# EAGLE design shield (EAGLE 9.6.2)
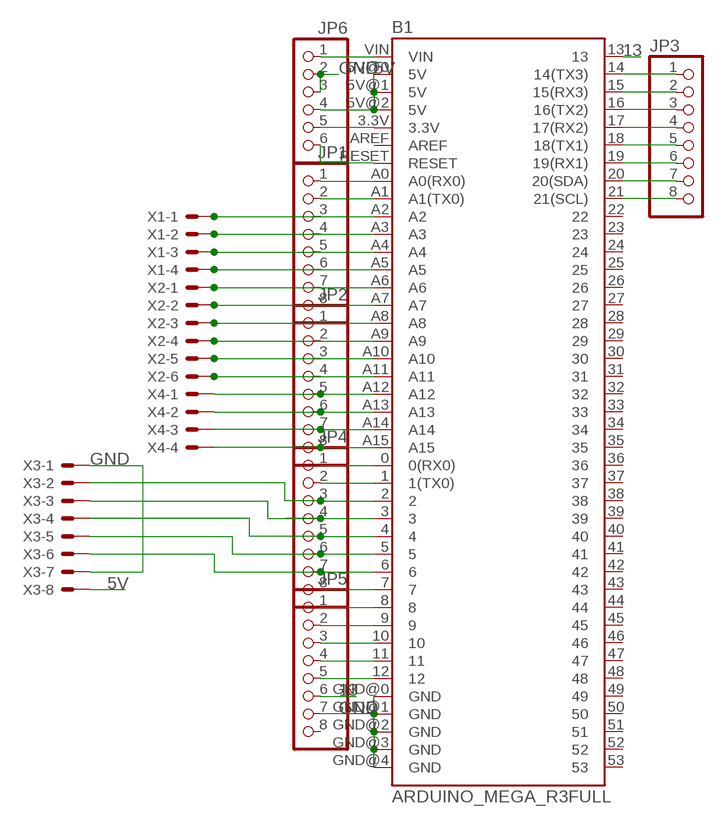
[diagram p0: schematic, sheet 1]

## Parts
B1  ARDUINO_MEGA_R3FULL  [ARDUINO_MEGA]
JP1  PINHD-1X8  [1X08]
JP2  PINHD-1X8  [1X08]
JP3  PINHD-1X8  [1X08]
JP4  PINHD-1X8  [1X08]
JP5  PINHD-1X8  [1X08]
JP6  PINHD-1X6  [1X06]
X1  JST-XH-04-PIN-LONG-PAD  [JST-XH-04-PACKAGE-LONG-PAD]
X2  JST-XH-06-PIN-LONG-PAD  [JST-XH-06-PACKAGE-LONG-PAD]
X3  JST-XH-08-PIN-LONG-PAD  [JST-XH-08-PACKAGE-LONG-PAD]
X4  JST-XH-04-PIN-LONG-PAD  [JST-XH-04-PACKAGE-LONG-PAD]

## Nets
5V: B1.5V@0(5V) B1.5V@1(5V) B1.5V@2(5V) JP6.4 X3.8
13: B1.13 JP5.6
GND: B1.GND@0(GND) B1.GND@1(GND) B1.GND@2(GND) B1.GND@3(GND) B1.GND@4(GND) JP5.7 JP6.2 JP6.3 X3.1 X3.7
N$1: B1.A0(A0(RX0)) JP1.1
N$2: B1.A1(A1(TX0)) JP1.2
N$3: B1.A2 JP1.3 X1.1
N$4: B1.A3 JP1.4 X1.2
N$5: B1.A4 JP1.5 X1.3
N$6: B1.A5 JP1.6 X1.4
N$7: B1.A6 JP1.7 X2.1
N$8: B1.A7 JP1.8 X2.2
N$9: B1.A8 JP2.1 X2.3
N$10: B1.A9 JP2.2 X2.4
N$11: B1.A10 JP2.3 X2.5
N$12: B1.A11 JP2.4 X2.6
N$13: B1.A12 JP2.5 X4.1
N$14: B1.A13 JP2.6 X4.2
N$15: B1.A14 JP2.7 X4.3
N$16: B1.A15 JP2.8 X4.4
N$17: B1.14(14(TX3)) JP3.1
N$18: B1.15(15(RX3)) JP3.2
N$19: B1.16(16(TX2)) JP3.3
N$20: B1.17(17(RX2)) JP3.4
N$21: B1.18(18(TX1)) JP3.5
N$22: B1.19(19(RX1)) JP3.6
N$23: B1.20(20(SDA)) JP3.7
N$24: B1.21(21(SCL)) JP3.8
N$25: B1.0(0(RX0)) JP4.1
N$26: B1.1(1(TX0)) JP4.2
N$27: B1.2 JP4.3 X3.2
N$29: B1.4 JP4.5 X3.4
N$32: B1.7 JP4.8
N$33: B1.8 JP5.1
N$34: B1.9 JP5.2
N$35: B1.10 JP5.3
N$36: B1.11 JP5.4
N$37: B1.12 JP5.5
N$38: B1.VIN JP6.1
N$39: B1.3.3V JP6.5
N$40: B1.RESET JP6.6
N$41: B1.3 JP4.4 X3.3
N$46: B1.5 JP4.6 X3.5
N$47: B1.6 JP4.7 X3.6
Unconnected: B1.22 B1.23 B1.24 B1.25 B1.26 B1.27 B1.28 B1.29 B1.30 B1.31 B1.32 B1.33 B1.34 B1.35 B1.36 B1.37 B1.38 B1.39 B1.40 B1.41 B1.42 B1.43 B1.44 B1.45 B1.46 B1.47 B1.48 B1.49 B1.50 B1.51 B1.52 B1.53 B1.AREF JP5.8

## Library data of the parts
B1 = SparkFun-Boards:ARDUINO_MEGA_R3: Arduino Mega R3 ATmega2560 R3 compatible footprint. SparkFun Products: Arduino Mega 2560 R3 <https://www.sparkfun.com/products/11061>
JP1-JP5 = pinhead:PINHD-1X8: PIN HEADER
JP6 = pinhead:PINHD-1X6: PIN HEADER
X1 X4 = JST:JST-XH-04-PIN: JST XH Connector 2 Pin Wire to board connector. Pitch: 2,54 mm, (0.100") Number of pins: 4 Created by Rembrandt Electronics www.rembrandtelectronics.com
X2 = JST:JST-XH-06-PIN: JST XH Connector 2 Pin Wire to board connector. Pitch: 2,54 mm, (0.100") Number of pins: 6 Created by Rembrandt Electronics www.rembrandtelectronics.com
X3 = JST:JST-XH-08-PIN: JST XH Connector 2 Pin Wire to board connector. Pitch: 2,54 mm, (0.100") Number of pins: 8 Created by Rembrandt Electronics www.rembrandtelectronics.com

## Net classes
0 default: width 0.3 mm, drill 0.203 mm, clearance 0.3 mm

## Board
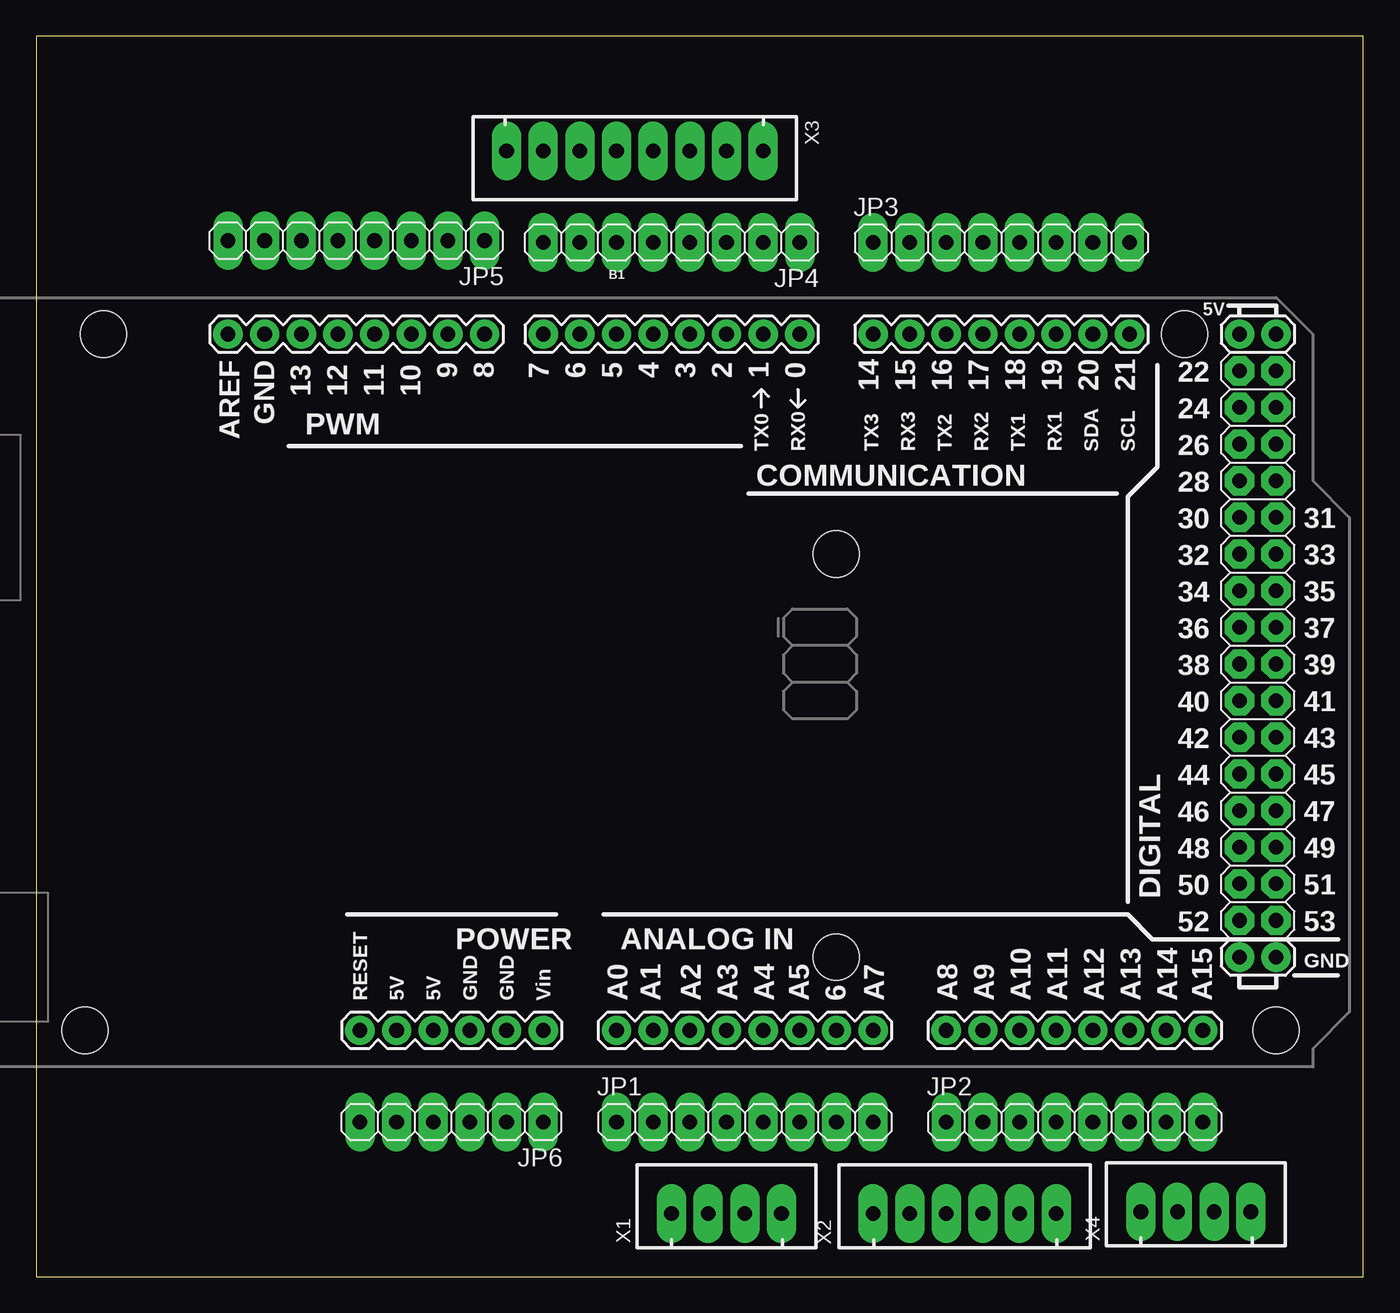
[diagram p1: board, top side]
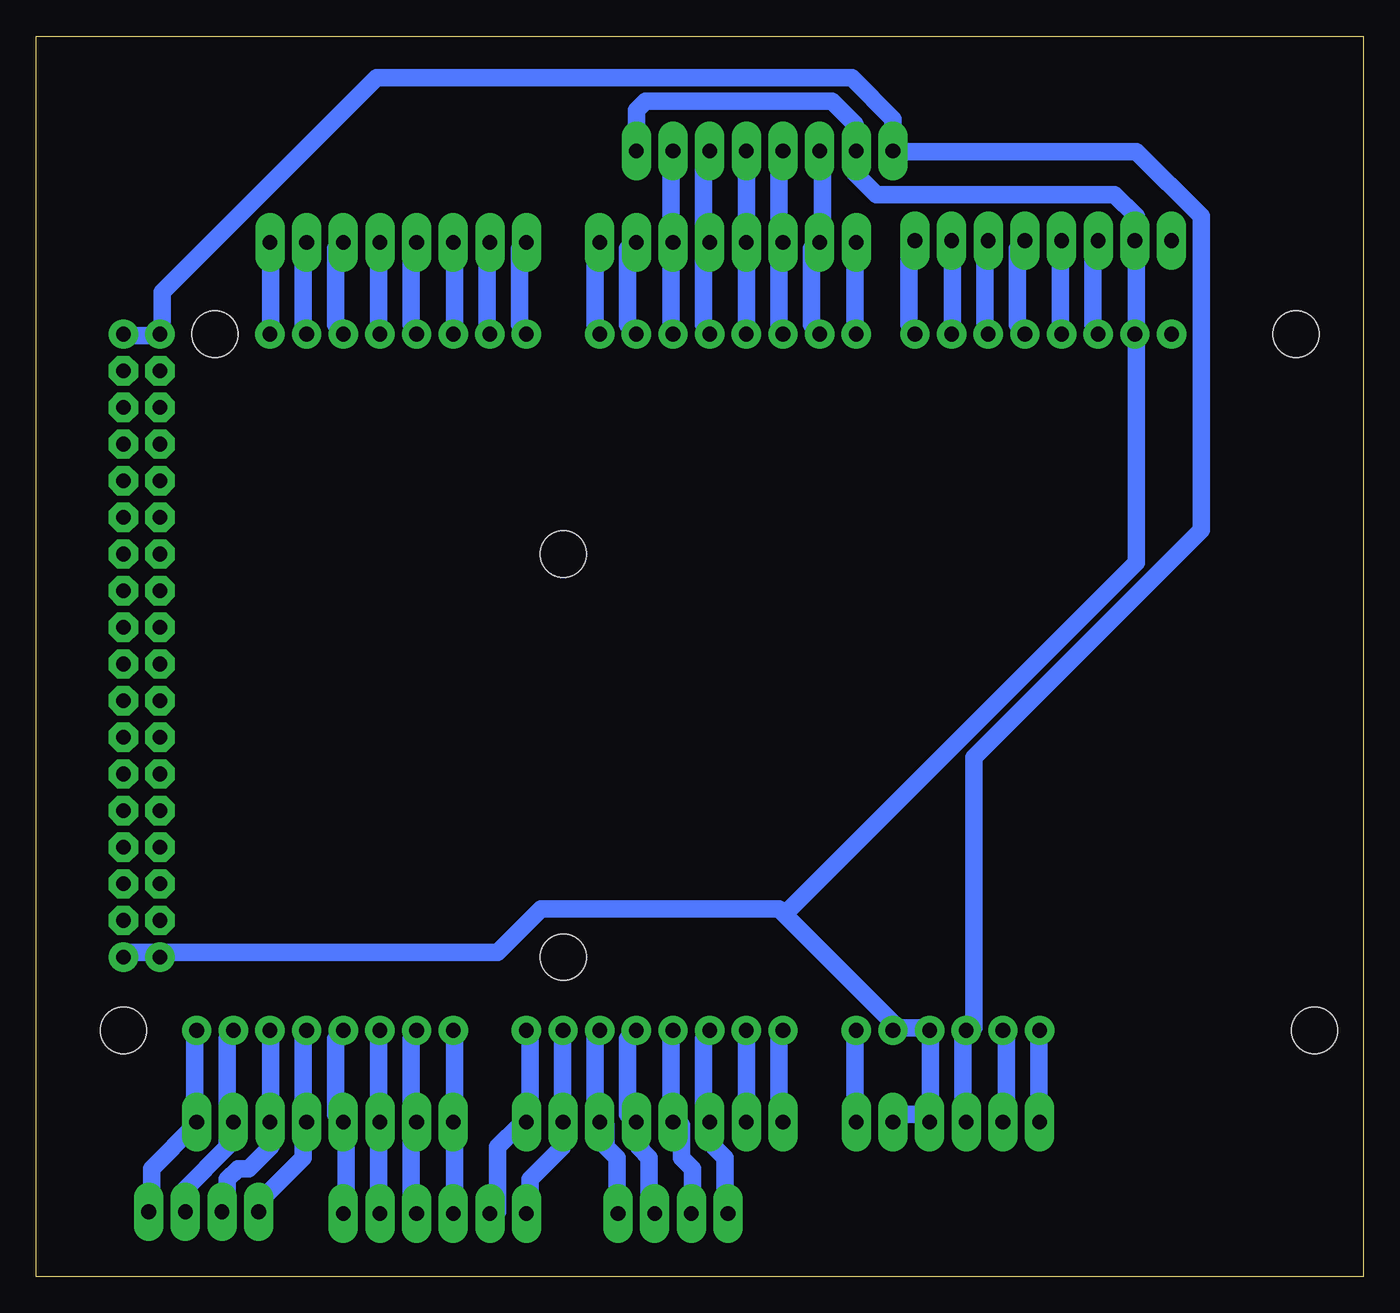
[diagram p2: board, bottom side, seen from below]

Size 92 x 86 mm. Coordinates in mm from the lower left corner, seen from the top.
Outline: 0,0 92,0 92,86 0,86 0,0
Copper layers (1*16): Top 0.035mm / dielectric 1.5mm / Bottom 0.035mm
Design rules "default *": minimum track width 1.2mm, minimum drill 0.65mm, track to track 6mil, track to pad 6mil, pad to pad 6mil, via to via 6mil, smd to smd 6mil, copper to edge 40mil, drill to drill 6mil, minimum pad ring 20mil, minimum via ring 8mil, stop-mask expansion 4mil, vias tented up to drill 0mil, thermal gap 10mil

### Footprints (pad centres in the part's own frame; a part is rotated, then mirrored left to right if it is on the bottom)
ARDUINO_MEGA = drill 1.016 pad 1.88: 0 13.97,24.13; 1 11.43,24.13; 2 8.89,24.13; 3 6.35,24.13; 3.3V -13.97,-24.13; 4 3.81,24.13; 5 1.27,24.13; 5V@0 -11.43,-24.13; 5V@1 44.45,24.13; 5V@2 46.99,24.13; 6 -1.27,24.13; 7 -3.81,24.13; 8 -7.874,24.13; 9 -10.414,24.13; 10 -12.954,24.13; 11 -15.494,24.13; 12 -18.034,24.13; 13 -20.574,24.13; 14 19.05,24.13; 15 21.59,24.13; 16 24.13,24.13; 17 26.67,24.13; 18 29.21,24.13; 19 31.75,24.13; 20 34.29,24.13; 21 36.83,24.13; A0 1.27,-24.13; A1 3.81,-24.13; A2 6.35,-24.13; A3 8.89,-24.13; A4 11.43,-24.13; A5 13.97,-24.13; A6 16.51,-24.13; A7 19.05,-24.13; A8 24.13,-24.13; A9 26.67,-24.13; A10 29.21,-24.13; A11 31.75,-24.13; A12 34.29,-24.13; A13 36.83,-24.13; A14 39.37,-24.13; A15 41.91,-24.13; AREF -25.654,24.13; GND@0 -8.89,-24.13; GND@1 -6.35,-24.13; GND@2 44.45,-19.05; GND@3 46.99,-19.05; GND@4 -23.114,24.13; RESET -16.51,-24.13; VIN -3.81,-24.13 | drill 1.016 pad 1.88 octagon: 22 44.45,21.59; 23 46.99,21.59; 24 44.45,19.05; 25 46.99,19.05; 26 44.45,16.51; 27 46.99,16.51; 28 44.45,13.97; 29 46.99,13.97; 30 44.45,11.43; 31 46.99,11.43; 32 44.45,8.89; 33 46.99,8.89; 34 44.45,6.35; 35 46.99,6.35; 36 44.45,3.81; 37 46.99,3.81; 38 44.45,1.27; 39 46.99,1.27; 40 44.45,-1.27; 41 46.99,-1.27; 42 44.45,-3.81; 43 46.99,-3.81; 44 44.45,-6.35; 45 46.99,-6.35; 46 44.45,-8.89; 47 46.99,-8.89; 48 44.45,-11.43; 49 46.99,-11.43; 50 44.45,-13.97; 51 46.99,-13.97; 52 44.45,-16.51; 53 46.99,-16.51 | hole 3.2: -34.29,24.13; -35.56,-24.13; 16.51,8.89; 16.51,-19.05; 40.64,24.13; 46.99,-24.13
1X08 = drill 1.016 long: 1 -8.89,0; 2 -6.35,0; 3 -3.81,0; 4 -1.27,0; 5 1.27,0; 6 3.81,0; 7 6.35,0; 8 8.89,0
1X06 = drill 1.016 long: 1 -6.35,0; 2 -3.81,0; 3 -1.27,0; 4 1.27,0; 5 3.81,0; 6 6.35,0
JST-XH-04-PACKAGE-LONG-PAD = drill 1.016 long: 1 -3.81,0; 2 -1.27,0; 3 1.27,0; 4 3.81,0
JST-XH-06-PACKAGE-LONG-PAD = drill 1.016 long: 1 -6.35,0; 2 -3.81,0; 3 -1.27,0; 4 1.27,0; 5 3.81,0; 6 6.35,0
JST-XH-08-PACKAGE-LONG-PAD = drill 1.016 long: 1 -8.89,0; 2 -6.35,0; 3 -3.81,0; 4 -1.27,0; 5 1.27,0; 6 3.81,0; 7 6.35,0; 8 8.89,0

### Placement (x,y rotation side)
B1  38.96,41.21 0 top
JP1  49.12,10.73 0 top
JP2  71.98,10.73 0 top
JP3  66.9,71.69 0 top
JP4  44.04,71.69 180 top
JP5  22.2,71.82 180 top
JP6  28.8,10.73 180 top
X1  47.85,4.38 0 top
X2  64.36,4.38 0 top
X3  41.5,78.04 180 top
X4  80.38,4.51 0 top

### Tracks (layer width: path | path; a pad name or v marks a point on that pad's centre or on a via)
5V
  Bottom 1.2: JP6.4 27.75,11.25 27.75,16.5 B1.5V@0 27,17.25 27,36 11.25,51.75 11.25,73.5 15.75,78 32.25,78 X3.8 32.6,80.25 35.45,83.1 68.4,83.1 83.25,68.25 83.25,66 B1.5V@1 84,65.25 85.5,65.25 B1.5V@2
13
  Bottom 1.2: B1.13 18.75,66 18.75,71.25 JP5.6
GND
  Bottom 1.2: X3.1 50.39,80.87 50.39,80.86 49.75,81.5 36.85,81.5 35.25,79.9 35.25,78.75 X3.7 35.25,78 35.25,76.5 33.75,75 17.25,75 15.75,73.5 15.75,72 JP5.7 15.75,71.25 15.75,66 B1.GND@4 15.75,65.25 15.75,49.5 40.12,25.12 | B1.GND@3 85.5,22.5 84,22.5 B1.GND@2 83.25,22.5 60,22.5 57,25.5 40.5,25.5 40.12,25.12 | JP6.2 32.25,11.25 30.75,11.25 JP6.3 30,11.25 30,16.5 B1.GND@0 30.75,17.25 32.25,17.25 | 32.25,17.25 40.12,25.12 | 32.25,17.25 B1.GND@1
N$1
  Bottom 1.2: JP1.1 40.5,11.25 40.5,16.5 B1.A0
N$2
  Bottom 1.2: JP1.2 42.75,11.25 42.75,16.5 B1.A1
N$3
  Bottom 1.2: X1.1 44.25,4.5 44.25,8.25 45,9 45,10.5 JP1.3 45.75,11.25 45.75,16.5 B1.A2
N$4
  Bottom 1.2: X1.2 46.5,4.5 46.5,7.5 47.25,8.25 47.25,10.5 JP1.4 48,11.25 48,16.5 B1.A3
N$5
  Bottom 1.2: X1.3 49.5,4.5 49.5,8.25 50.25,9 50.25,10.5 JP1.5 51,11.25 51,16.5 B1.A4
N$6
  Bottom 1.2: X1.4 51.75,4.5 51.75,8.25 52.5,9 52.5,10.5 JP1.6 53.25,11.25 53.25,16.5 B1.A5
N$7
  Bottom 1.2: B1.A6 55.5,16.5 55.5,11.25 JP1.7 55.5,10.5 55.5,9 57.75,6.75 57.75,4.5 X2.1
N$8
  Bottom 1.2: B1.A7 57.75,16.5 57.75,11.25 JP1.8 58.5,10.5 60,9 60,4.5 X2.2
N$9
  Bottom 1.2: X2.3 63,4.5 63,10.5 JP2.1 63,11.25 63,16.5 B1.A8
N$10
  Bottom 1.2: X2.4 66,4.5 66,10.5 JP2.2 66,11.25 66,16.5 B1.A9
N$11
  Bottom 1.2: X2.5 68.25,4.5 68.25,10.5 JP2.3 68.25,11.25 68.25,16.5 B1.A10
N$12
  Bottom 1.2: X2.6 70.5,4.5 70.5,10.5 JP2.4 71.25,11.25 71.25,16.5 B1.A11
N$13
  Bottom 1.2: B1.A12 73.5,16.5 73.5,11.25 JP2.5 73.5,10.5 73.5,8.25 76.5,5.25 X4.1
N$14
  Bottom 1.2: B1.A13 75.75,16.5 75.75,11.25 JP2.6 75.75,10.5 75.75,9 77.25,7.5 78,7.5 78.75,6.75 78.75,5.25 X4.2
N$15
  Bottom 1.2: B1.A14 78.75,16.5 78.75,11.25 JP2.7 78.75,10.5 78.75,9 81.75,6 81.75,5.25 X4.3
N$16
  Bottom 1.2: B1.A15 81,16.5 81,11.25 JP2.8 81,10.5 84,7.5 84,5.25 X4.4
N$17
  Bottom 1.2: B1.14 58.5,66 58.5,71.25 JP3.1
N$18
  Bottom 1.2: B1.15 60.75,66 60.75,71.25 JP3.2
N$19
  Bottom 1.2: B1.16 63,66 63,71.25 JP3.3
N$20
  Bottom 1.2: B1.17 66,66 66,71.25 JP3.4
N$21
  Bottom 1.2: B1.18 68.25,66 68.25,71.25 JP3.5
N$22
  Bottom 1.2: B1.19 71.25,66 71.25,71.25 JP3.6
N$23
  Bottom 1.2: B1.20 73.5,66 73.5,71.25 JP3.7
N$24
  Bottom 1.2: B1.21 75.75,66 75.75,71.25 JP3.8
N$25
  Bottom 1.2: B1.0 53.25,66 53.25,71.25 JP4.1
N$26
  Bottom 1.2: B1.1 51,66 51,71.25 JP4.2
N$27
  Bottom 1.2: B1.2 48,66 48,71.25 JP4.3 48,72 48,78 X3.2
N$29
  Bottom 1.2: B1.4 42.75,66 42.75,71.25 JP4.5 42.75,72 42.75,78 X3.4
N$32
  Bottom 1.2: B1.7 35.25,66 35.25,71.25 JP4.8
N$33
  Bottom 1.2: B1.8 31.5,66 31.5,71.25 JP5.1
N$34
  Bottom 1.2: B1.9 28.5,66 28.5,71.25 JP5.2
N$35
  Bottom 1.2: B1.10 26.25,66 26.25,71.25 JP5.3
N$36
  Bottom 1.2: B1.11 24,66 24,71.25 JP5.4
N$37
  Bottom 1.2: B1.12 21,66 21,71.25 JP5.5
N$38
  Bottom 1.2: JP6.1 35.25,11.25 35.25,16.5 B1.VIN
N$39
  Bottom 1.2: JP6.5 24.75,11.25 24.75,16.5 B1.3.3V
N$40
  Bottom 1.2: JP6.6 22.5,11.25 22.5,16.5 B1.RESET
N$41
  Bottom 1.2: B1.3 45.75,66 45.75,71.25 JP4.4 45.75,72 45.75,78 X3.3
N$46
  Bottom 1.2: B1.5 40.5,66 40.5,71.25 JP4.6 40.5,72 40.5,78 X3.5
N$47
  Bottom 1.2: B1.6 38.25,66 38.25,71.25 JP4.7 37.5,72 37.5,78 X3.6